# Altium schematic sheet PLL.SchDoc
size A4; SheetNumber: 15; SheetTotal: 15
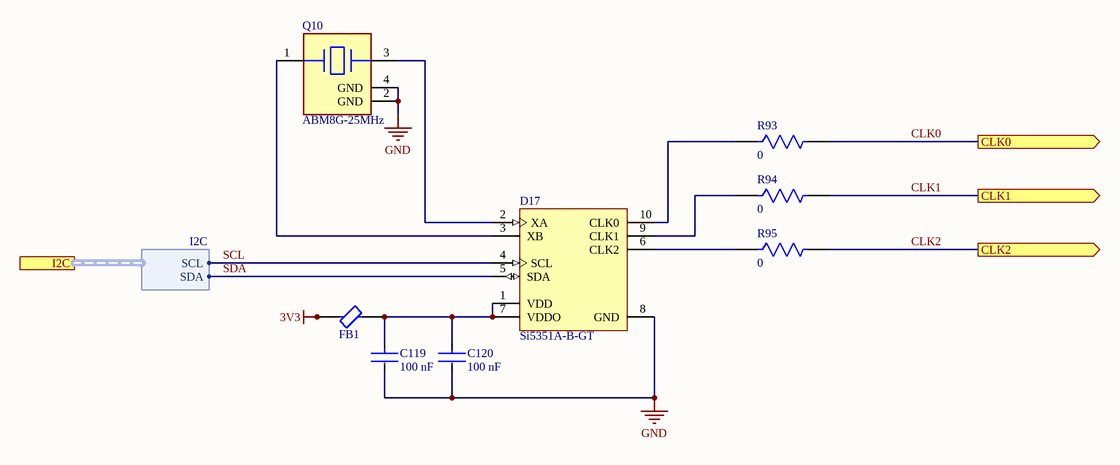
[diagram p0: PLL.SchDoc]

## Parts
C119  Capacitance: 100 nF  [CC0805]  (hidden comment: CC0805-1.5pF)
C120  Capacitance: 100 nF  [CC0805]  (hidden comment: CC0805-1.5pF)
D17  Si5351A-B-GT  [SLAB-MSOP-10_L]
FB1  BLM21AG601SN1J  [FP-BLM21-0_2-t0_85-e0_5-IPC_A]  (value not drawn)
Q10  ABM8G-25MHz  [FP-ABM8G-MFG]
R93  Resistance: 0  [CR0805]  (hidden comment: CR0805-51)
R94  Resistance: 0  [CR0805]  (hidden comment: CR0805-51)
R95  Resistance: 0  [CR0805]  (hidden comment: CR0805-51)

## Ports
CLK0 (out), CLK1 (out), CLK2 (out), I2C (harness I2C)

## Harnesses
I2C: SDA, SCL

## Nets
3V3: FB1.1
GND: C119.2 C120.2 D17.8(GND) Q10.2(GND) Q10.4(GND)
CLK0: R93.2 ; port CLK0
CLK1: R94.2 ; port CLK1
CLK2: R95.2 ; port CLK2
SCL: D17.4(SCL) ; port I2C.SCL
SDA: D17.5(SDA) ; port I2C.SDA
NetC119_1: C119.1 C120.1 D17.1(VDD) D17.7(VDDO) FB1.2
NetD17_2: D17.2(XA) Q10.3
NetD17_3: D17.3(XB) Q10.1
NetD17_6: D17.6(CLK2) R95.1
NetD17_9: D17.9(CLK1) R94.1
NetD17_10: D17.10(CLK0) R93.1

## Library data of the parts
C119 C120 = CC0805: CL21 Series 0805 1.5pF 50V ±0.25pF Tolerance C0G Multilayer Ceramic Chip Capacitor; Manufacturer Part Number: CL21C1R5CBANNNC; Manufacturer: Samsung; Category: Cap; value: 1.5pF; Case/Package: 0805
D17 = Si5351A-B-GT: I2C-Programmable Any-Frequency CMOS Clock Generator + VCXO, 2.5 / 3.3 V, 0.008 to 160 MHz Output, -40 to 85 degC, 10-pin SOP; Manufacturer: Silicon Labs; PackageDescription: 10-Pin Mini Small Outline Package, Body 3 x 3 mm, Pitch 0.5 mm; PartNumber: Si5351A-B-GT; Manufacturer Part Number: SI5351A-B-GT; value: SI5351A-B-GT; Case/Package: MSOP-10; Category: IC
FB1 = BLM21AG601SN1J: Chip Ferrite Bead, 0805, 600Ω @ 100MHz, 0.2Ω, 25%, 700mA; Manufacturer: Murata; Number of Pins: 2; Case/Package: 0805; Termination: Flat; Manufacturer Part Number: BLM21AG601SN1J; value: BLM21AG601SN1J; Category: Inductor
Q10 = ABM8G-25MHz: CRYSTAL 25.0000MHZ 10PF SMD; Manufacturer: Abracon; Manufacturer Part Number: ABM8G-25.000MHZ-B4Y-T; value: ABM8G-25.000MHZ-B4Y-T; Termination: SMD/SMT; Case/Package: SMD/SMT; Number of Pins: 4; Category: CrystalsandOscillators
R93-R95 = CR0805: 51Ω ±0.5% 0.1W 1/10W Chip Resistor 0805 (2012 Metric) Thin Film; Manufacturer: Susumu; Manufacturer Part Number: RR1220Q-510-D; Case/Package: 0805; Number of Pins: 2; Termination: SMD/SMT; value: 51Ω; Category: Res; Number of Terminations: 2